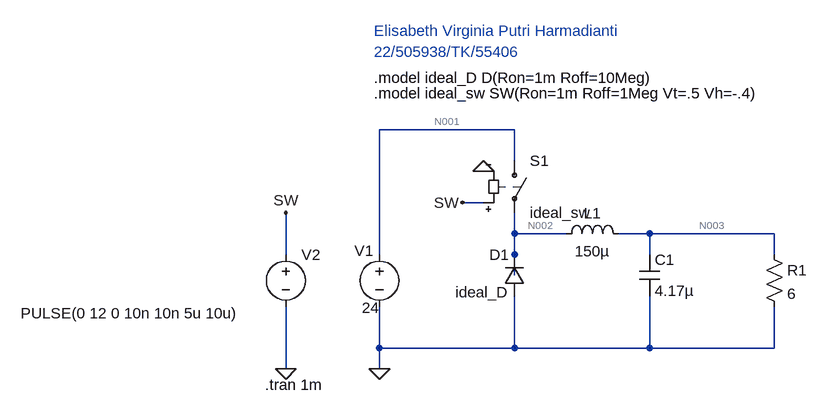
[diagram p0: schematic task1LTSPICE_openloop.asc]
task1LTSPICE_openloop.asc, the LTspice schematic file:
Version 4
SHEET 1 880 680
WIRE 224 -80 16 -80
WIRE 224 -32 224 -80
WIRE 176 32 144 32
WIRE 224 80 224 48
WIRE 304 80 224 80
WIRE 432 80 384 80
WIRE 624 80 432 80
WIRE -128 112 -128 48
WIRE 16 112 16 -80
WIRE 224 112 224 80
WIRE 432 112 432 80
WIRE 624 112 624 80
WIRE 224 144 224 112
WIRE 16 256 16 192
WIRE 224 256 224 176
WIRE 224 256 16 256
WIRE 432 256 432 176
WIRE 432 256 224 256
WIRE 624 256 624 192
WIRE 624 256 432 256
WIRE -128 288 -128 192
WIRE 16 288 16 256
FLAG 176 -16 0
FLAG 16 288 0
FLAG -128 48 SW
FLAG -128 288 0
FLAG 144 32 SW
SYMBOL voltage 16 96 R0
WINDOW 0 -38 10 Left 2
WINDOW 3 -27 98 Left 2
WINDOW 123 0 0 Left 0
WINDOW 39 0 0 Left 0
SYMATTR InstName V1
SYMATTR Value 24
SYMBOL ind 288 96 R270
WINDOW 0 32 56 VTop 2
WINDOW 3 5 56 VBottom 2
SYMATTR InstName L1
SYMATTR Value 150µ
SYMBOL cap 416 112 R0
SYMATTR InstName C1
SYMATTR Value 4.17µ
SYMBOL res 608 96 R0
SYMATTR InstName R1
SYMATTR Value 6
SYMBOL sw 224 -48 R0
SYMATTR InstName S1
SYMATTR Value ideal_sw
SYMBOL diode 240 176 R180
WINDOW 0 24 64 Left 2
WINDOW 3 25 6 Left 2
SYMATTR InstName D1
SYMATTR Value ideal_D
SYMBOL voltage -128 96 R0
WINDOW 3 -408 106 Left 2
WINDOW 123 0 0 Left 0
WINDOW 39 0 0 Left 0
SYMATTR Value PULSE(0 12 0 10n 10n 5u 10u)
SYMATTR InstName V2
TEXT 8 -160 Left 2 !.model ideal_D D(Ron=1m Roff=10Meg)
TEXT 8 -136 Left 2 !.model ideal_sw SW(Ron=1m Roff=1Meg Vt=.5 Vh=-.4)
TEXT 8 -232 Left 2 ;Elisabeth Virginia Putri Harmadianti
TEXT 8 -200 Left 2 ;22/505938/TK/55406
TEXT -160 312 Left 2 !.tran 1m

The netlist it stands for:
* task1LTSPICE_openloop.asc
V1 N001 0 24
L1 N002 N003 150µ
C1 N003 0 4.17µ
R1 N003 0 6
S1 N001 N002 SW 0 ideal_sw
D1 0 N002 ideal_D
V2 SW 0 PULSE(0 12 0 10n 10n 5u 10u)
.model D D
.lib standard.dio
.model ideal_D D(Ron=1m Roff=10Meg)
.model ideal_sw SW(Ron=1m Roff=1Meg Vt=.5 Vh=-.4)
* Elisabeth Virginia Putri Harmadianti
* 22/505938/TK/55406
.tran 1m
.backanno
.end

* Results of the author's LTspice run, read from the files saved beside the schematic
* Operating Point, zero values left out:
*   V(n001) = 24 V
*   V(n002) = 144 µV
*   V(n003) = 144 µV
*   I(D1) = -14.4 pA
*   I(L1) = 24 µA
*   I(R1) = 24 µA
*   I(S1) = -24 µA
*   I(V1) = -24 µA
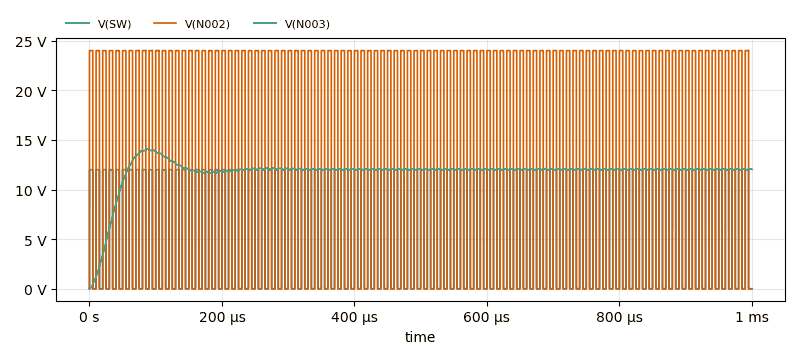
[diagram p1: Transient Analysis of task1LTSPICE_openloop.asc, plotted from the saved traces]
* Transient Analysis, 1 run:
*   V(SW): min -2.497 µV, max 12 V, average 6.012 V, rms 8.493 V, last 0 V
*   V(N002): min -2.806 mV, max 24.02 V, average 12.04 V, rms 17 V, last -1.806 mV
*   V(N003): min 144 µV, max 14.07 V, average 11.77 V, rms 11.91 V, last 12.04 V